# EAGLE design v1 (EAGLE 8.4.2)

## Sheet 1 of 2
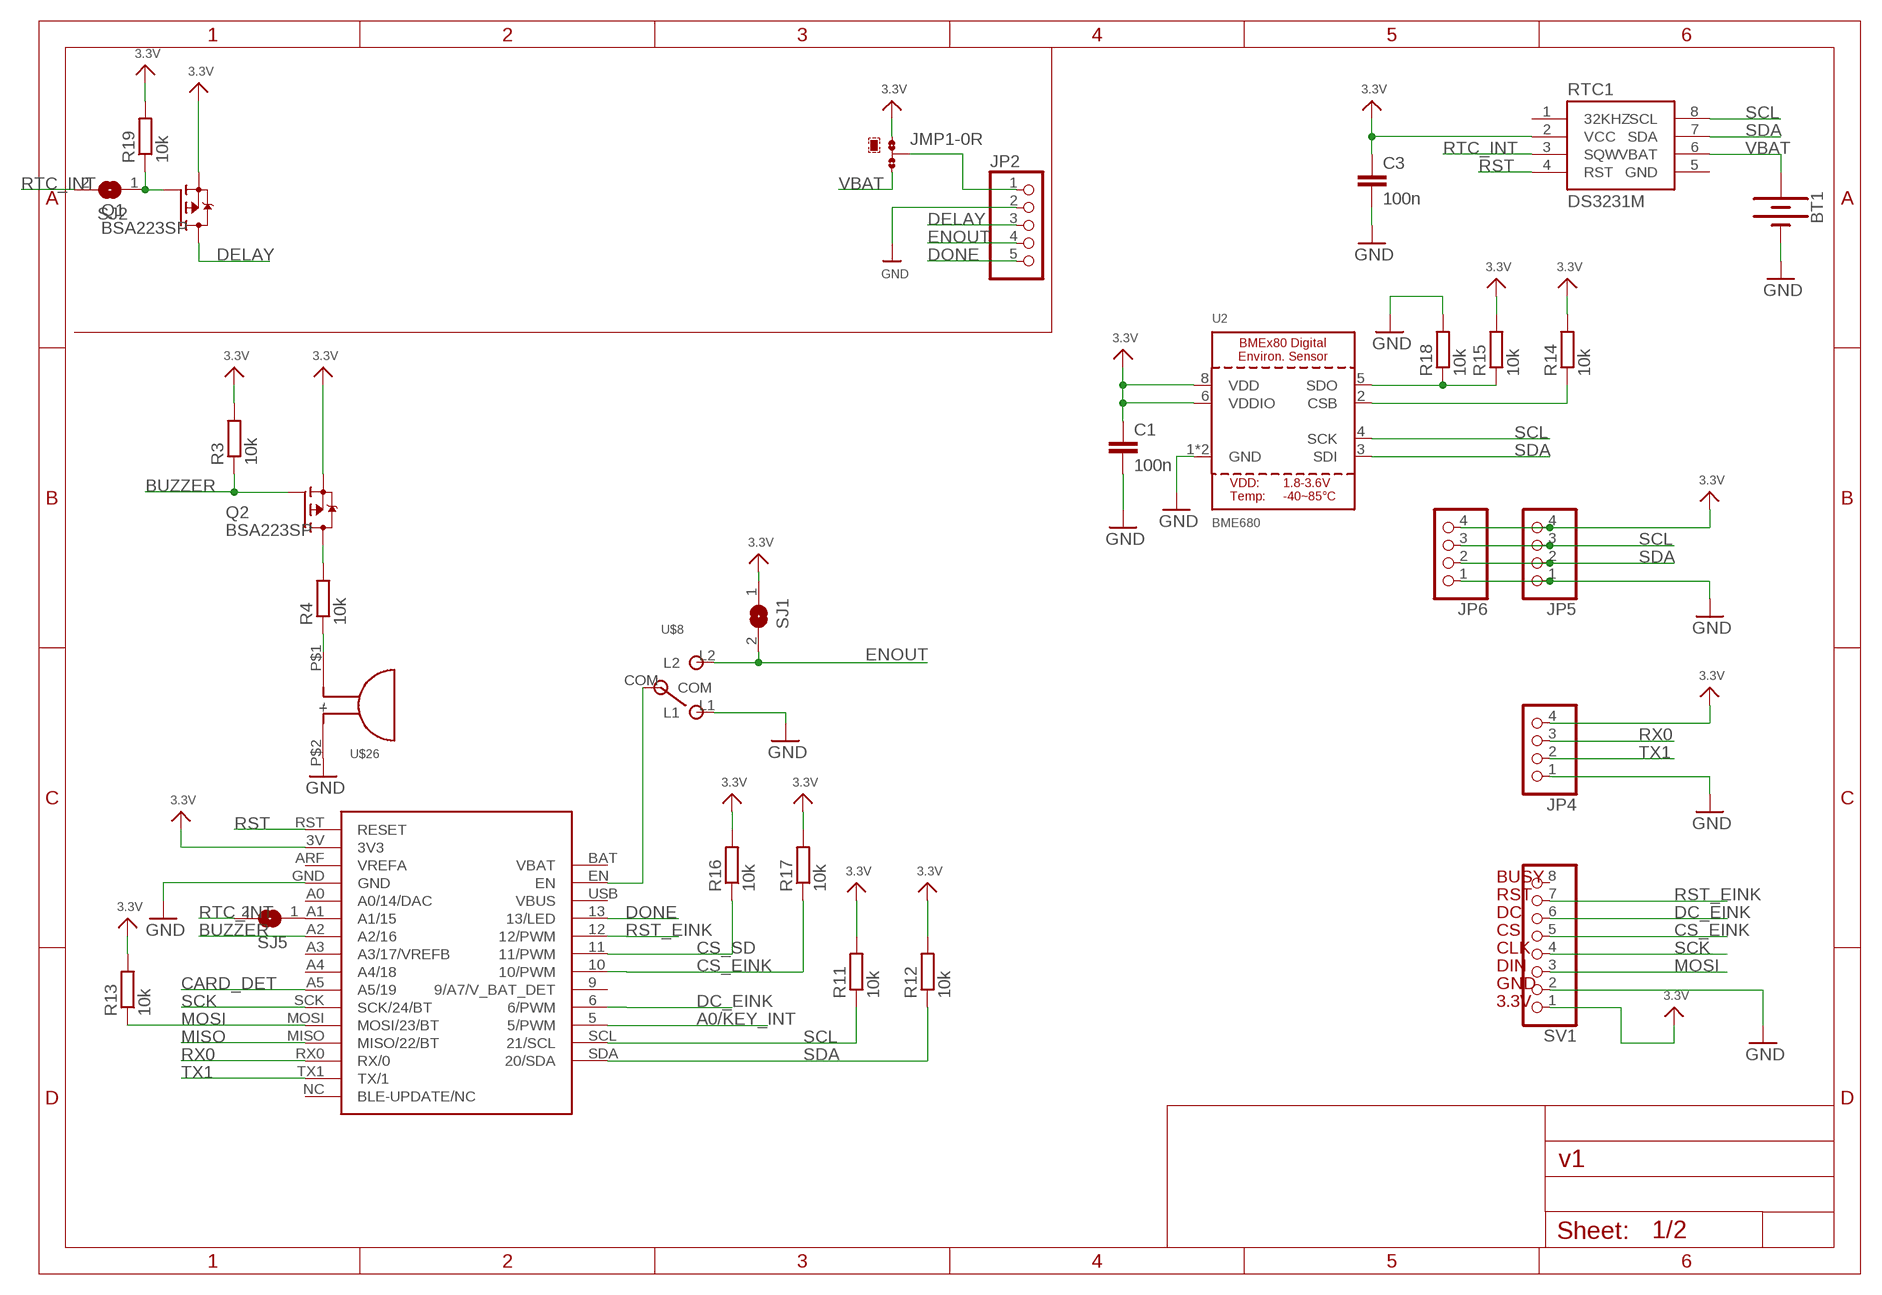
[diagram p0: schematic, sheet 1]

### Parts
BT1  BATTERY-12MM_SMD  [BATTCON_12MM]
C1  100n  C-EUC0805  [C0805]
C3  100n  C-EUC0805  [C0805]
JMP1  0R-JUMPC  [C0R-JMP]
JP2  HEADER-1X570MIL  [1X05_ROUND_70]
JP4  PINHD-1X04_2.54  [1X04]
JP5  PINHD-1X04_2.54  [1X04]
JP6  PINHD-1X04_2.54  [1X04]
Q1  BSA223SP  [SC75_INFINEON]
Q2  BSA223SP  [SC75_INFINEON]
R3  10k  R-EU_R0805  [R0805]
R4  10k  R-EU_R0805  [R0805]
R11  10k  R-EU_R0805  [R0805]
R12  10k  R-EU_R0805  [R0805]
R13  10k  R-EU_R0805  [R0805]
R14  10k  R-EU_R0805  [R0805]
R15  10k  R-EU_R0805  [R0805]
R16  10k  R-EU_R0805  [R0805]
R17  10k  R-EU_R0805  [R0805]
R18  10k  R-EU_R0805  [R0805]
R19  10k  R-EU_R0805  [R0805]
RTC1  DS3231M  [SO08]
SJ1  SOLDERJUMPERCLOSED  [SOLDERJUMPER_CLOSEDWIRE]
SJ2  SOLDERJUMPERCLOSED  [SOLDERJUMPER_CLOSEDWIRE]
SJ5  SOLDERJUMPERCLOSED  [SOLDERJUMPER_CLOSEDWIRE]
SV1  PINHD-1X08_2.54  [1X08]
U2  BME680  BME280  [BME280]
U$8  MSK-12C02_SMD_SPDT_SWITCH  [MSK-12C02]
U$15  FEATHER_M0  [FEATHER_M0]
U$26  DTS402G1  [DET402G1]

### Nets
3.3V: C1.1 C3.1 JMP1.1 JP4.4 JP5.4 JP6.4 Q1.3(S) Q2.3(S) R3.2 R11.2 R12.2 R13.2 R14.2 R15.2 R16.2 R17.2 R19.2 RTC1.2(VCC) SJ1.1 SV1.1 U2.6(VDDIO) U2.8(VDD) U$15.3V(3V3) ; also sheet 2
A0/KEY_INT: U$15.5(5/PWM) ; also sheet 2
BUZZER: Q2.1(G) R3.1 U$15.A2(A2/16)
CARD_DET: U$15.A5(A5/19) ; also sheet 2
CS_EINK: R17.1 SV1.5 U$15.10(10/PWM)
CS_SD: R16.1 U$15.11(11/PWM) ; also sheet 2
DC_EINK: SV1.6 U$15.6(6/PWM)
DELAY: JP2.3 Q1.2(D) ; also sheet 2
DONE: JP2.5 U$15.13(13/LED)
ENOUT: JP2.4 SJ1.2 U$8.L2
GND: BT1.GND(-) C1.2 C3.2 JP2.2 JP4.1 JP5.1 JP6.1 R18.2 SV1.2 U2.1(GND) U2.7(GND) U$8.L1 U$15.GND U$26.P$2(-) ; also sheet 2
MISO: U$15.MISO(MISO/22/BT) ; also sheet 2
MOSI: R13.1 SV1.3 U$15.MOSI(MOSI/23/BT) ; also sheet 2
N$1: JMP1.2 JP2.1
N$2: Q1.1(G) R19.1 SJ2.1
N$5: R14.1 U2.2(CSB)
N$6: SJ5.1 U$15.A1(A1/15)
N$7: U$8.COM U$15.EN
N$8: Q2.2(D) R4.2
N$9: R4.1 U$26.P$1(+)
N$12: R15.1 R18.1 U2.5(SDO)
RST: RTC1.4(RST) U$15.RST(RESET)
RST_EINK: SV1.7 U$15.12(12/PWM)
RTC_INT: RTC1.3(SQW) SJ2.2 SJ5.2
RX0: JP4.3 U$15.RX0(RX/0)
SCK: SV1.4 U$15.SCK(SCK/24/BT) ; also sheet 2
SCL: JP5.3 JP6.3 R11.1 RTC1.8(SCL) U2.4(SCK) U$15.SCL(21/SCL) ; also sheet 2
SDA: JP5.2 JP6.2 R12.1 RTC1.7(SDA) U2.3(SDI) U$15.SDA(20/SDA) ; also sheet 2
TX1: JP4.2 U$15.TX1(TX/1)
VBAT: BT1.PWR@1(+) JMP1.3 RTC1.6(VBAT)
Unconnected: RTC1.1(32KHZ) SV1.8 U$15.9(9/A7/V_BAT_DET) U$15.A0(A0/14/DAC) U$15.A3(A3/17/VREFB) U$15.A4(A4/18) U$15.ARF(VREFA) U$15.BAT(VBAT) U$15.NC(BLE-UPDATE/NC) U$15.USB(VBUS)

### Notes on the sheet
- BUSY
- RST
- DC
- CS
- CLK
- DIN
- GND
- 3.3V

## Sheet 2 of 2
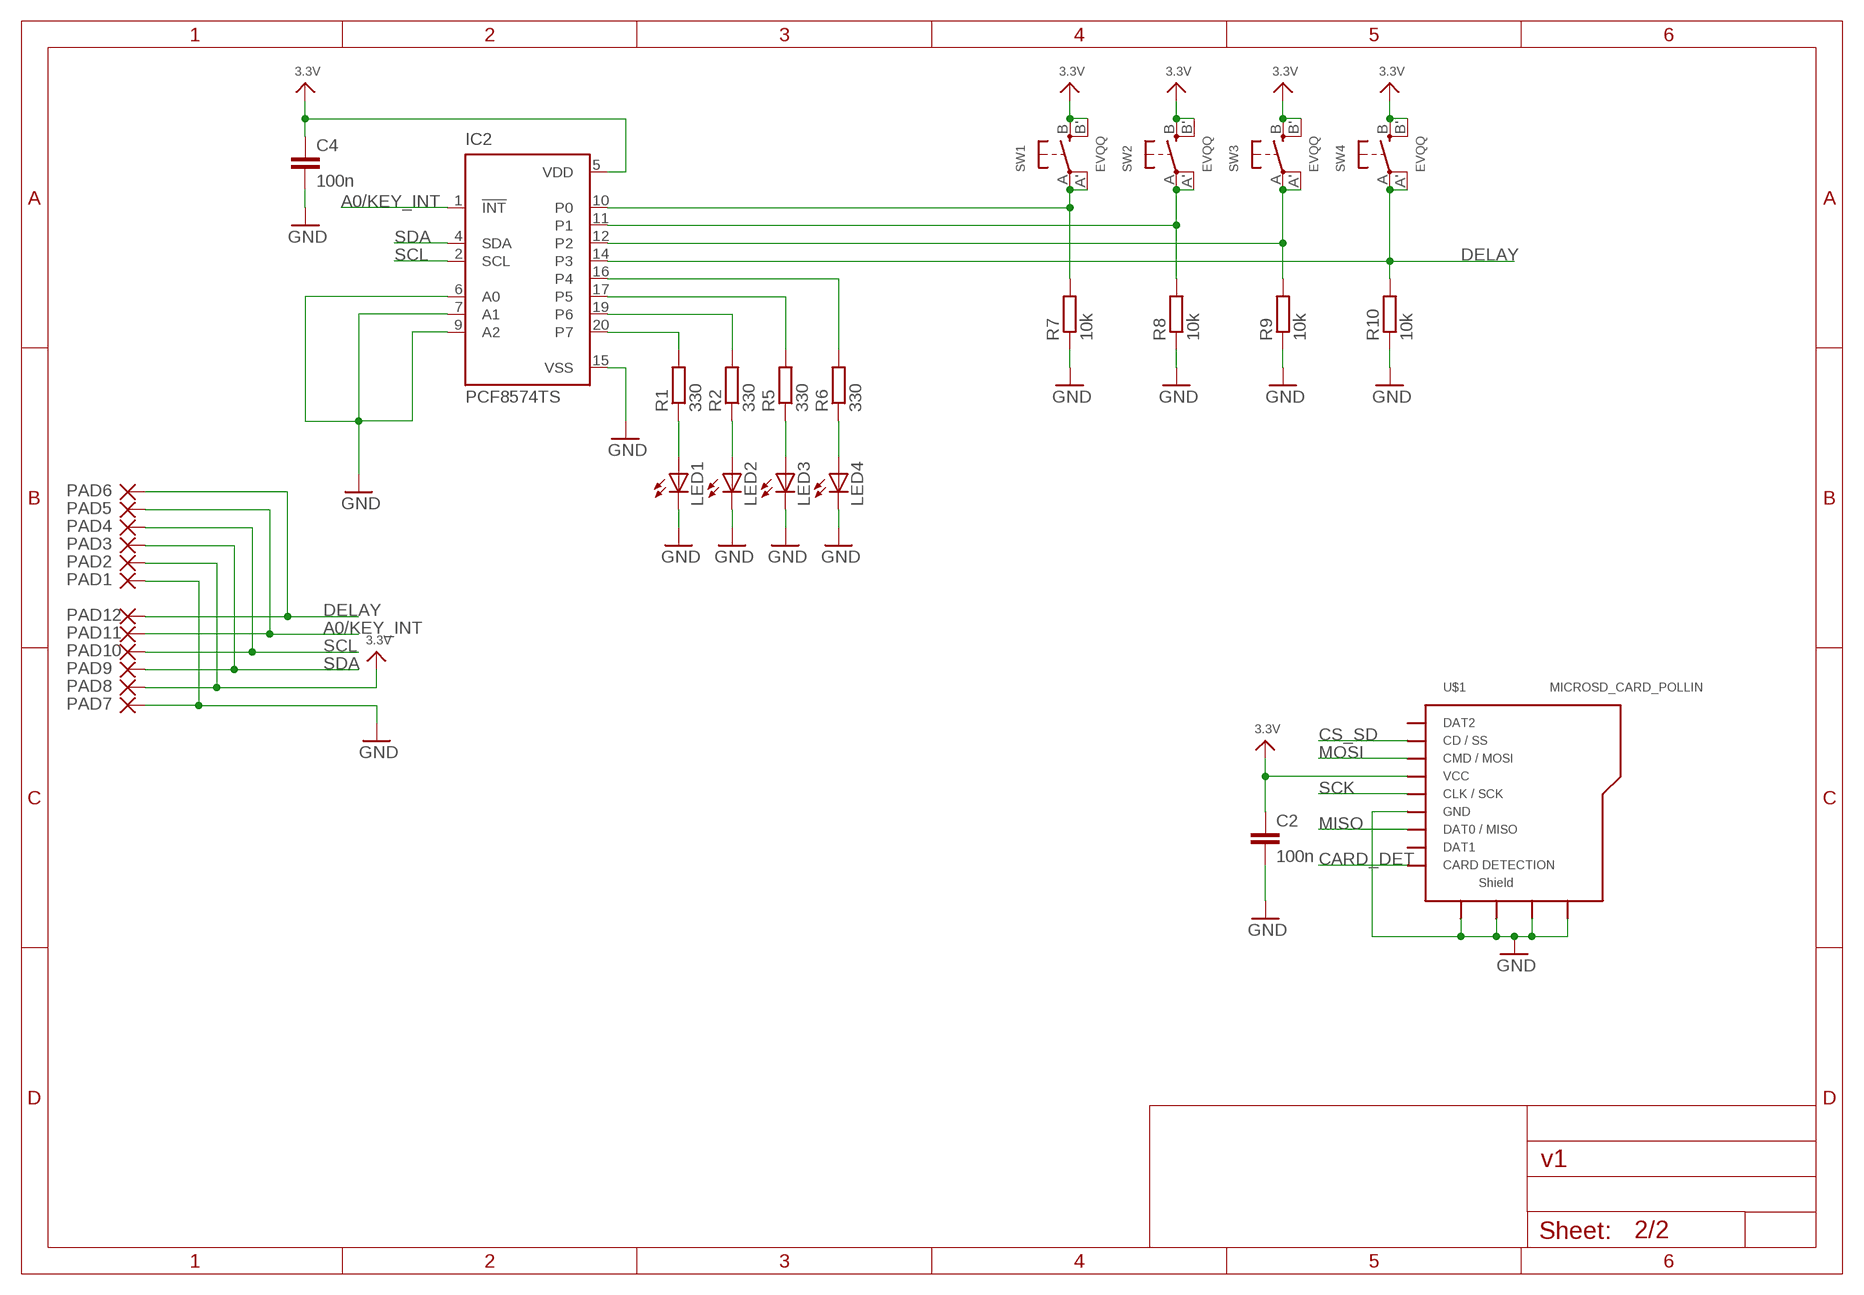
[diagram p1: schematic, sheet 2]

### Parts
C2  100n  C-EUC0805  [C0805]
C4  100n  C-EUC0805  [C0805]
IC2  PCF8574TS  [SSOP20]
LED1  LEDCHIPLED_0805  [CHIPLED_0805]
LED2  LEDCHIPLED_0805  [CHIPLED_0805]
LED3  LEDCHIPLED_0805  [CHIPLED_0805]
LED4  LEDCHIPLED_0805  [CHIPLED_0805]
PAD1  WIREPADSMD1,27-254  [SMD1,27-2,54]
PAD2  WIREPADSMD1,27-254  [SMD1,27-2,54]
PAD3  WIREPADSMD1,27-254  [SMD1,27-2,54]
PAD4  WIREPADSMD1,27-254  [SMD1,27-2,54]
PAD5  WIREPADSMD1,27-254  [SMD1,27-2,54]
PAD6  WIREPADSMD1,27-254  [SMD1,27-2,54]
PAD7  WIREPADSMD1,27-254  [SMD1,27-2,54]
PAD8  WIREPADSMD1,27-254  [SMD1,27-2,54]
PAD9  WIREPADSMD1,27-254  [SMD1,27-2,54]
PAD10  WIREPADSMD1,27-254  [SMD1,27-2,54]
PAD11  WIREPADSMD1,27-254  [SMD1,27-2,54]
PAD12  WIREPADSMD1,27-254  [SMD1,27-2,54]
R1  330  R-EU_R0805  [R0805]
R2  330  R-EU_R0805  [R0805]
R5  330  R-EU_R0805  [R0805]
R6  330  R-EU_R0805  [R0805]
R7  10k  R-EU_R0805  [R0805]
R8  10k  R-EU_R0805  [R0805]
R9  10k  R-EU_R0805  [R0805]
R10  10k  R-EU_R0805  [R0805]
SW1  EVQQ  SWITCH_TACT_SMT_EVQQ2_SMALL  [EVQ-Q2_SMALLER]
SW2  EVQQ  SWITCH_TACT_SMT_EVQQ2_SMALL  [EVQ-Q2_SMALLER]
SW3  EVQQ  SWITCH_TACT_SMT_EVQQ2_SMALL  [EVQ-Q2_SMALLER]
SW4  EVQQ  SWITCH_TACT_SMT_EVQQ2_SMALL  [EVQ-Q2_SMALLER]
U$1  MICROSD_CARD_POLLIN  [MR**-AP*03**]

### Nets
3.3V: C2.1 C4.1 IC2.5(VDD) PAD2.1(P) PAD8.1(P) SW1.B'(S1) SW1.B(S) SW2.B'(S1) SW2.B(S) SW3.B'(S1) SW3.B(S) SW4.B'(S1) SW4.B(S) U$1.VCC ; also sheet 1
A0/KEY_INT: IC2.1(!INT) PAD5.1(P) PAD11.1(P) ; also sheet 1
CARD_DET: U$1.CARD_DETECTION(CARD_D) ; also sheet 1
CS_SD: U$1.DAT3/CS(CD/SS) ; also sheet 1
DELAY: IC2.14(P3) PAD6.1(P) PAD12.1(P) R10.2 SW4.A'(P1) SW4.A(P) ; also sheet 1
GND: C2.2 C4.2 IC2.6(A0) IC2.7(A1) IC2.9(A2) IC2.15(VSS) LED1.C LED2.C LED3.C LED4.C PAD1.1(P) PAD7.1(P) R7.1 R8.1 R9.1 R10.1 U$1.GND U$1.SHD_1(SHD1) U$1.SHD_2(SHD2) U$1.SHD_3(SHD3) U$1.SHD_4(SHD4) ; also sheet 1
MISO: U$1.DAT0(DAT0/MISO) ; also sheet 1
MOSI: U$1.CMD(CMD/MOSI) ; also sheet 1
N$3: IC2.10(P0) R7.2 SW1.A'(P1) SW1.A(P)
N$4: IC2.11(P1) R8.2 SW2.A'(P1) SW2.A(P)
N$13: IC2.12(P2) R9.2 SW3.A'(P1) SW3.A(P)
N$20: IC2.20(P7) R1.2
N$21: IC2.19(P6) R2.2
N$22: IC2.17(P5) R5.2
N$23: IC2.16(P4) R6.2
N$24: LED4.A R6.1
N$25: LED3.A R5.1
N$26: LED2.A R2.1
N$27: LED1.A R1.1
SCK: U$1.CLK(CLK/SCK) ; also sheet 1
SCL: IC2.2(SCL) PAD4.1(P) PAD10.1(P) ; also sheet 1
SDA: IC2.4(SDA) PAD3.1(P) PAD9.1(P) ; also sheet 1
Unconnected: U$1.DAT1 U$1.DAT2

## Power pins joined to a net without a drawn wire
GND: RTC1.5(GND)

## Library data of the parts
BT1 = SparkFun-Batteries:BATTERY: Battery - Single Cell A variety of battery chemistries, sizes, and footprints. Device List: 20MM_PTH - Coin Cell Battery Holder - 20mm (PTH) <https://www.sparkfun.com/products/783> 6.8MM_PTH - Coin Cell Battery Holder - 6.8MM(SMD) <https://www.digikey.com/product-detail/en/seiko-instruments/MS621FE-FL11E/728-1057-ND/1889208?WT.srch=1&gclid=CNOQ5a6LzdQCFZS2wAodXCkE0g> 12MM_SMD - Coin Cell Battery Holder - 12mm (SMD) <https://www.sparkfun.com/products/10592> 12MM_PTH - Coin Cell Battery Holder - 12mm (PTH) <https://www.sparkfun.com/products/7948> 20MM_SMD - 20mm Coin Cell Battery Holder (SMD) (2 legs) Used on the Big Time Watch Kit <https://www.sparkfun.com/products/11734> 20MM_SMD_4LEGS - Coin Cell Battery Holder - 20mm (SMD) <https://www.sparkfun.com/products/11892> 20MM_SMD_4LEGS_OVERPASTE - Coin Cell Battery Holder - 20mm (SMD) <https://www.sparkfun.com/products/11892> (Over-paste on the legs) 24.5MM_PTH - Coin Cell Battery Holder - 24.5mm (PTH) <https://www.sparkfun.com/products/8863> 9V - 9V Battery Holder - PC Mount Used on the SparkFun SparkPunk Sound Kit <https://www.sparkfun.com/products/11177> and SparkFun SparkPunk Sequencer Kit <https://www.sparkfun.com/products/12707> 18650 - Battery Holder - 18650 (PTH) <https://www.sparkfun.com/products/13113> AA - Battery Holder - 1xAA (PTH) <https://www.sparkfun.com/products/7949> AAA - Battery Holder - 1xAAA (PTH) <https://www.sparkfun.com/products/12718> AA_KIT - Battery Holder - 1xAA (PTH) <https://www.sparkfun.com/products/7949> Special kit package - pads only have exposed copper on one side of the board. AAA_KIT - Battery Holder - 1xAAA (PTH) <https://www.sparkfun.com/products/12718> Special kit package - pads only have exposed copper on one side of the board.; PROD_ID: BATT-08044; SF_SKU: PRT-10592
C1-C4 = rcl:C-EU: CAPACITOR, European symbol
IC2 = micro-philips:PCF8574: I2C-Bus Remote 8-bit I/O expander http://www.semiconductors.philips.com/acrobat_download/datasheets/PCF8574_4.pdf; MPN: PCF8574TS/3,118; OC_FARNELL: 1506644; OC_NEWARK: 70R6873
JMP1 = jump-0r-smd:0R-JUMP: SMD 0R 0805 Jumper
JP2 = microbuilder:HEADER-1X5: PIN HEADER
JP4-JP6 = pinhead-2:PINHD-1X04: PIN HEADER
LED1-LED4 = led:LED: LED OSRAM: - CHIPLED LG R971, LG N971, LY N971, LG Q971, LY Q971, LO R971, LY R971 LH N974, LH R974 LS Q976, LO Q976, LY Q976 LO Q996 - Hyper CHIPLED LW Q18S LB Q993, LB Q99A, LB R99A - SideLED LS A670, LO A670, LY A670, LG A670, LP A670 LB A673, LV A673, LT A673, LW A673 LH A674 LY A675 LS A676, LA A676, LO A676, LY A676, LW A676 LS A679, LY A679, LG A679 - Hyper Micro SIDELED® LS Y876, LA Y876, LO Y876, LY Y876 LT Y87S - SmartLED LW L88C, LW L88S LB L89C, LB L89S, LG L890 LS L89K, LO L89K, LY L89K LS L896, LA L896, LO L896, LY L896 - TOPLED LS T670, LO T670, LY T670, LG T670, LP T670 LSG T670, LSP T670, LSY T670, LOP T670, LYG T670 LG T671, LOG T671, LSG T671 LB T673, LV T673, LT T673, LW T673 LH T674 LS T676, LA T676, LO T676, LY T676, LB T676, LH T676, LSB T676, LW T676 LB T67C, LV T67C, LT T67C, LS T67K, LO T67K, LY T67K, LW E67C LS E67B, LA E67B, LO E67B, LY E67B, LB E67C, LV E67C, LT E67C LW T67C LS T679, LY T679, LG T679 LS T770, LO T770, LY T770, LG T770, LP T770 LB T773, LV T773, LT T773, LW T773 LH T774 LS E675, LA E675, LY E675, LS T675 LS T776, LA T776, LO T776, LY T776, LB T776 LHGB T686 LT T68C, LB T68C - Hyper Mini TOPLED® LB M676 - Mini TOPLED Santana® LG M470 LS M47K, LO M47K, LY M47K Source: http://www.osram.convergy.de LUXEON: - LUMILED® LXK2-PW12-R00, LXK2-PW12-S00, LXK2-PW14-U00, LXK2-PW14-V00 LXK2-PM12-R00, LXK2-PM12-S00, LXK2-PM14-U00 LXK2-PE12-Q00, LXK2-PE12-R00, LXK2-PE12-S00, LXK2-PE14-T00, LXK2-PE14-U00 LXK2-PB12-K00, LXK2-PB12-L00, LXK2-PB12-M00, LXK2-PB14-N00, LXK2-PB14-P00, LXK2-PB14-Q00 LXK2-PR12-L00, LXK2-PR12-M00, LXK2-PR14-Q00, LXK2-PR14-R00 LXK2-PD12-Q00, LXK2-PD12-R00, LXK2-PD12-S00 LXK2-PH12-R00, LXK2-PH12-S00 LXK2-PL12-P00, LXK2-PL12-Q00, LXK2-PL12-R00 Source: www.luxeon.com KINGBRIGHT: KA-3528ASYC Source: www.kingbright.com
PAD1-PAD12 = wirepad:WIREPAD: Wire PAD connect wire on PCB
Q1 Q2 = transistor-fet:BSA223SP: OptiMOS(R)-P Small-Signal-Transistor P-Channel, Enhancement mode, Super Logic Level (2.5 V rated) Source: http://www.infineon.com/upload/Document/BSA223SP_Rev1.3.pdf
R1-R19 = rcl:R-EU_: RESISTOR, European symbol
RTC1 = SparkFun-Clocks:DS3231M: DS3231M Real Time Clock Accuracy +/-5ppm. Battery Backup. 2.3V to 5.5V. Datasheet <https://cdn.sparkfun.com/datasheets/Dev/Beagle/DS3231M.pdf> SparkFun Products CryptoCape <https://www.sparkfun.com/products/12773> (DEV-12773) SparkFun CryptoShield <https://www.sparkfun.com/products/13183> (DEV-13183); PROD_ID: IC-11985
SJ1 SJ2 SJ5 = microbuilder:SOLDERJUMPER: SMD Solder JUMPER Solder the two pads together to create a connection, or remove the solder to break it. REFLOW - Use this footprint for solder paste and reflow ovens. WAVE - Use this footprint for hand-soldering (larger pads). CLOSED - Has a trace between the two pads to ensure it is closed by default. The trace needs to be cut to disable the jumper, and can be closed again by creating a solder bridge between the two pads.
SV1 = pinhead-2:PINHD-1X08: PIN HEADER
SW1-SW4 = microbuilder:SWITCH_TACT_SMT: SMT Tact Switches 6x6mm - Digikey: P12940SCT-ND KMR2 (4.6x2.8mm) - Digikey: 401-1426-1-ND EVQ-PQHB55 - Light Touch, 160GF (4.5x4.5mm) - Digikey: P8090SCT-ND KMT0 - KMT021 NGJ LHS (etc.) IP68/Waterproof - Digikey: CKN10289CT-ND
U2 = microbuilder:BME280: BME280 - Environmental Sensor (I2C + SPI)
U$1 = 000_eigene_Bauteile:MICROSD_CARD_POLLIN
U$8 = MSK-12C02 SMD Micro Slider Switch SPDT:MSK-12C02_SMD_SPDT_SWITCH: Footprint of the VIMEX MSK-12C02 SPDT SMD Switch Created by mzst on 17-Jan-2016
U$15 = 000_Simons_Eigene:FEATHER_M0
U$26 = 000_Simons_Eigene:DTS402G1

## Board
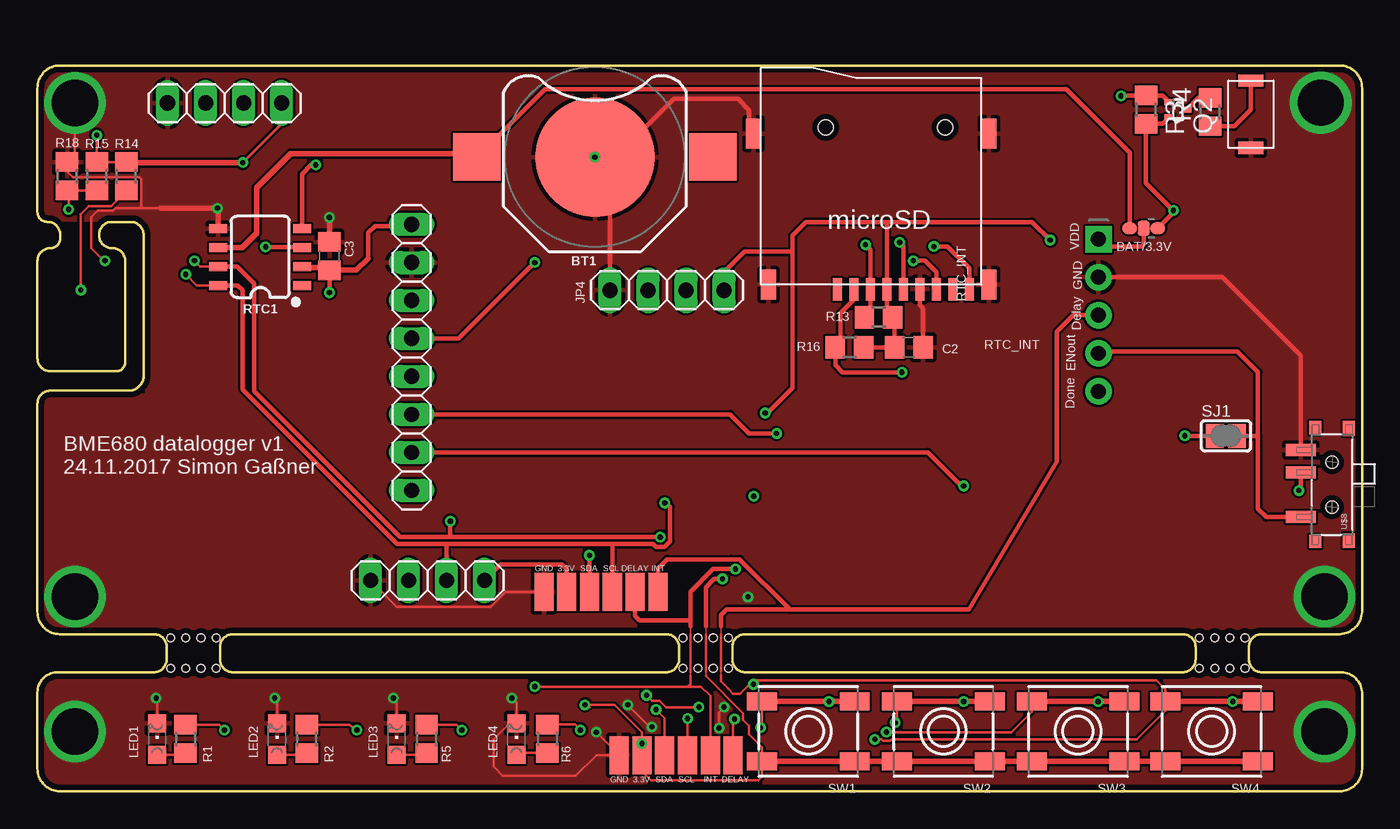
[diagram p2: board, top side]
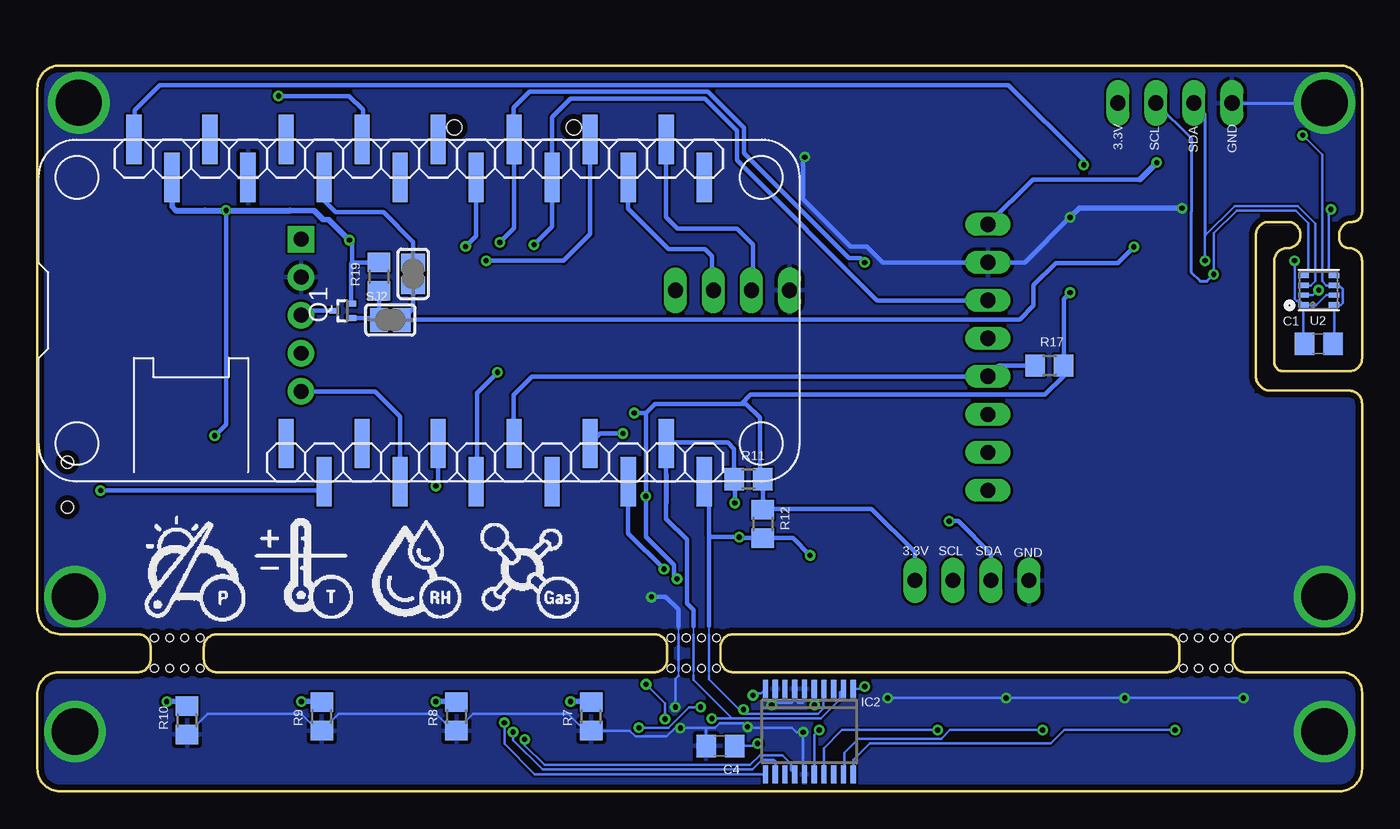
[diagram p3: board, bottom side, seen from below]

Size 88.5 x 48.5 mm. Coordinates in mm from the lower left corner, seen from the top.
Outline: 4.98,38.05 6.23,38.05 arc-90 7.09,37.19 7.09,27.95 arc-90 6.23,26.78 0.87,26.78 arc90 0,25.91 0,12 arc90 1.5,10.5 7.77,10.5 arc-90 8.64,9.64 8.64,8.82 arc-90 7.77,7.96 1.27,7.96 arc90 0,6.5 0,1.5 arc90 1.5,0 87,0 arc90 88.5,1.5 88.5,6.5 arc90 87.12,7.96 81.8,7.96 arc-90 80.94,8.82 80.94,9.64 arc-90 81.8,10.5 86.87,10.5 arc90 88.5,12 88.5,47 arc90 87,48.5 1.5,48.5 arc90 0,47 0,38.72 arc90 0.66,38.05 arc-90 1.53,37.19 1.53,36.96 arc-90 0.87,36.3 arc90 0,35.44 0,28.94 arc90 0.87,28.07 5.26,28.07 arc90 5.87,28.68 5.87,35.44 arc90 5.01,36.3 4.98,36.3 arc-90 4.12,37.17 4.12,37.19 arc-90 4.98,38.05
Outline: 42,10.5 13.06,10.5 arc90 12.19,9.64 12.19,8.82 arc90 13.06,7.96 42,7.96 arc90 42.87,8.82 42.87,9.64 arc90 42,10.5
Outline: 47.29,10.5 76.52,10.5 arc-90 77.38,9.64 77.38,8.82 arc-90 76.52,7.96 47.29,7.96 arc-90 46.42,8.82 46.42,9.64 arc-90 47.29,10.5
Copper layers (1*16): Top 0.0356mm / dielectric 1.5011mm / Bottom 0.0356mm
Design rules "oshpark-2layer *": minimum track width 6mil, minimum drill 13mil, track to track 6mil, track to pad 6mil, pad to pad 6mil, via to via 6mil, smd to smd 6mil, copper to edge 15mil, drill to drill 6mil, minimum pad ring 7mil, minimum via ring 7mil, stop-mask expansion 2.5mil, vias tented up to drill 14mil, thermal gap 10mil
Holes 0.51 mm at 8.89,10.25 9.91,10.25 10.92,10.25 11.94,10.25 8.89,8.21 9.91,8.21 10.92,8.21 11.94,8.21 77.63,10.25 78.65,10.25 79.67,10.25 80.68,10.25 77.63,8.21 78.65,8.21 79.67,8.21 80.68,8.21 43.12,10.25 44.14,10.25 45.15,10.25 46.17,10.25 43.12,8.21 44.14,8.21 45.15,8.21 46.17,8.21
tRestrict: area 0,26.6 to 7.2,38.1
bRestrict: area 0,26.6 to 7.2,38.1

### Footprints (pad centres in the part's own frame; a part is rotated, then mirrored left to right if it is on the bottom)
BATTCON_12MM = smd 8 x 8: GND 0,0 | smd 3.175 x 3.175: PWR@1 -7.874,0; PWR@2 7.874,0
C0805 = smd 1.3 x 1.5: 1 -0.95,0; 2 0.95,0
SSOP20 = smd 0.35 x 1.2: 1 -2.925,-2.85; 2 -2.275,-2.85; 3 -1.625,-2.85; 4 -0.975,-2.85; 5 -0.325,-2.85; 6 0.325,-2.85; 7 0.975,-2.85; 8 1.625,-2.85; 9 2.275,-2.85; 10 2.925,-2.85; 11 2.925,2.85; 12 2.275,2.85; 13 1.625,2.85; 14 0.975,2.85; 15 0.325,2.85; 16 -0.325,2.85; 17 -0.975,2.85; 18 -1.625,2.85; 19 -2.275,2.85; 20 -2.925,2.85
C0R-JMP = smd 0.8 x 1: 1 0,0.938; 3 0,-0.938 | smd 1 x 0.8: 2 0,0
1X05_ROUND_70 = drill 1 pad 1.778 square: 1 -5.08,0 | drill 1 pad 1.778: 2 -2.54,0; 3 0,0; 4 2.54,0; 5 5.08,0
1X04 = drill 1.016 long: 1 -3.81,0; 2 -1.27,0; 3 1.27,0; 4 3.81,0
CHIPLED_0805 = smd 1.2 x 1.2: A 0,-1.05; C 0,1.05
SMD1,27-2,54 = smd 1.27 x 2.54: 1 0,0
SC75_INFINEON = smd 0.4 x 0.65: 1 -0.5,-0.575; 2 0,0.575; 3 0.5,-0.575
R0805 = smd 1.3 x 1.5: 1 -0.95,0; 2 0.95,0
SO08 = smd 0.6 x 1.2: 1 -1.905,-2.8; 2 -0.635,-2.8; 3 0.635,-2.8; 4 1.905,-2.8; 5 1.905,2.8; 6 0.635,2.8; 7 -0.635,2.8; 8 -1.905,2.8
SOLDERJUMPER_CLOSEDWIRE = smd 1.168 x 1.6: 1 -0.762,0; 2 0.762,0 | smd 0.635 x 0.203: WIRE 0,0
1X08 = drill 1.016 long: 1 -8.89,0; 2 -6.35,0; 3 -3.81,0; 4 -1.27,0; 5 1.27,0; 6 3.81,0; 7 6.35,0; 8 8.89,0
EVQ-Q2_SMALLER = smd 2 x 1.2: A -3.1,-2; A' 3.1,-2; B -3.1,2; B' 3.1,2
BME280 = smd 0.7 x 0.35: 1 1.025,0.975; 2 1.025,0.325; 3 1.025,-0.325; 4 1.025,-0.975; 5 -1.025,-0.975; 6 -1.025,-0.325; 7 -1.025,0.325; 8 -1.025,0.975
MR**-AP*03** = smd 0.6 x 1.5: CARD_DETECTION -6.55,0.3; CLK -2.15,0.3; CMD 0.05,0.3; DAT0 -4.35,0.3; DAT1 -5.45,0.3; DAT2 2.25,0.3; DAT3/CS 1.15,0.3; GND -3.25,0.3; VCC -1.05,0.3 | smd 1 x 2: SHD_1 -7.85,0; SHD_2 6.85,0; SHD_3 -7.85,-10.1; SHD_4 7.85,-10.1 | hole 1: -4.95,-10.5; 3.05,-10.5
MSK-12C02 = smd 0.8 x 2: COM 0.823,2.1; L1 2.323,2.1; L2 -2.177,2.1 | smd 1 x 0.8: GND@1 -3.75,-1.125; GND@4 3.75,-1.125 | smd 0.9 x 0.8: GND@2 -3.8,1.125; GND@3 3.8,1.125 | hole 0.8: -1.5,0; 1.5,0
FEATHER_M0 = smd 1.016 x 3.302 bottom: 3V -16.51,-9.525; 5 13.97,10.795; 6 11.43,8.255; 9 8.89,10.795; 10 6.35,8.255; 11 3.81,10.795; 12 1.27,8.255; 13 -1.27,10.795; A0 -8.89,-12.065; A1 -6.35,-9.525; A2 -3.81,-12.065; A3 -1.27,-9.525; A4 1.27,-12.065; A5 3.81,-9.525; ARF -13.97,-12.065; BAT -8.89,8.255; EN -6.35,10.795; GND -11.43,-9.525; MISO 11.43,-12.065; MOSI 8.89,-9.525; NC 19.05,-9.525; RST -19.05,-12.065; RX0 13.97,-9.525; SCK 6.35,-12.065; SCL 16.51,8.255; SDA 19.05,10.795; TX1 16.51,-12.065; USB -3.81,8.255
DET402G1 = smd 1.676 x 0.813: P$1 0,2.25; P$2 0,-2.25

### Placement (x,y rotation side)
BT1  37.24,42.39 0 top
C1  2.9,29.9 180 bottom
C2  58.22,29.67 0 top
C3  19.51,35.77 90 top
C4  42.88,3.03 180 bottom
IC2  36.93,4 180 bottom
JMP1  73.92,37.63 270 top
JP2  70.89,31.81 270 top
JP4  42.07,33.48 0 top
JP5  26.06,14.09 0 top
JP6  12.5,46 0 top
LED1  8,3.5 0 top
LED2  16,3.5 0 top
LED3  24,3.5 0 top
LED4  32,3.5 0 top
PAD1  33.84,13.33 0 top
PAD2  35.36,13.33 0 top
PAD3  36.88,13.33 0 top
PAD4  38.41,13.33 0 top
PAD5  39.93,13.33 0 top
PAD6  41.46,13.33 0 top
PAD7  38.86,2.42 0 top
PAD8  40.39,2.42 0 top
PAD9  41.91,2.42 0 top
PAD10  43.44,2.42 0 top
PAD11  44.96,2.42 0 top
PAD12  46.48,2.42 0 top
Q1  68.13,32.11 90 bottom
Q2  76.2,45.55 270 top
R1  9.89,3.5 90 top
R2  18,3.5 90 top
R3  74.07,45.55 270 top
R4  78.34,45.4 90 top
R5  26,3.5 90 top
R6  34.07,3.51 90 top
R7  51.5,5 90 bottom
R8  60.5,5 90 bottom
R9  69.5,5 90 bottom
R10  78.5,4.75 90 bottom
R11  41,20.86 0 bottom
R12  40.04,17.87 90 bottom
R13  56.2,31.68 0 top
R14  5.95,41.1 90 top
R15  3.97,41.1 90 top
R16  54.26,29.67 0 top
R17  20.88,28.45 0 bottom
R18  1.98,41.1 90 top
R19  65.69,34.4 90 bottom
RTC1  14.88,35.72 90 top
SJ1  79.4,23.76 0 top
SJ2  64.93,31.5 0 bottom
SJ5  63.4,34.58 270 bottom
SV1  25,29 270 top
SW1  51.5,4 180 top
SW2  60.53,4 180 top
SW3  69.53,4 180 top
SW4  78.45,4 180 top
U2  2.9,33.48 180 bottom
U$1  55.71,33.86 180 top
U$8  86.5,20.5 90 top
U$14  GASLOGO45MM  [BME680_LOGO_30MM]  81.75,10.96 0 bottom
U$15  63,31.5 180 top
U$26  81.08,45.25 0 top

### Tracks (layer width: path | path; a pad name or v marks a point on that pad's centre or on a via)
3.3V  (via drill 0.35)
  Top 0.102: 44.66,7.76 44.66,8 | 44.66,11.03 44.66,10.5
  Top 0.152: v3.96,43.85 R15.2 R14.2 | 36.88,5.62 36.73,5.62 v36.58,5.78 38.56,5.78 40.39,3.95 v40.39,3.18 PAD8.1 40.39,1.97 40.24,1.81 40.24,1.51 41,0.75 48.16,0.75 48.4,0.99 SW1.B' 48.4,2.94 47.55,3.79 47.55,4.38 47.15,4.78 47.15,5.23 44.66,7.72 44.66,7.76 | 44.66,10.5 44.66,8
  Top 0.203: JP6.4 16.31,44.61 v13.72,42.02
  Top 0.305: 56.77,38.05 51.36,38.05 50.45,37.14 50.45,36.07 | 56.77,38.05 66.45,38.05 v67.67,36.84 | v19.51,33.33 C3.1 | R16.2 C2.1 57.27,31.57 R13.2 56.76,32.08 U$1.VCC 56.77,33.57 56.77,38.05 | JP4.4 45.87,34.7 47.25,36.07 50.45,36.07 | 44.66,11.03 44.66,13.63 45.22,14.2 v45.77,14.2 | PAD2.1 35.36,14.85 35.05,15.16 30.94,15.16 JP5.4 | 22.1,35.62 22.1,37.32 22.56,37.78 24.89,37.78 SV1.1 | v48.62,25.28 48.77,25.28 50.45,26.96 50.45,36.07 | JMP1.1 75.9,38.67 v75.9,38.82 74.07,40.65 R3.2 75.18,44.6 Q2.3 | v76.66,23.76 SJ1.1
  Top 0.381: SW4.B SW4.B' SW3.B SW3.B' SW2.B SW2.B' SW1.B SW1.B' | RTC1.2 17.75,35.01 19.05,35.01 19.24,34.82 C3.1 21.3,34.82 22.1,35.62 | R14.2 5.98,42.02 v13.72,42.02
  Bottom 0.152: IC2.5 36.6,5.8 v36.58,5.78 | C1.1 1.84,29.88 1.87,29.92 U2.8 1.43,32.51 1.3,32.64 1.3,32.89 1.29,32.89 1.29,33.56 1.55,33.81 U2.6 2.38,33.81 2.67,34.09 2.67,42.55 v3.96,43.85 | v40.39,3.18 40.54,3.04 C4.1
  Bottom 0.305: v19.51,33.33 19.93,32.91 R17.2 19.93,27.76 21.19,26.5 40.85,26.5 41.46,25.89 | R11.2 40.2,20.83 | R19.2 67.48,35.35 | v45.77,14.2 45.98,14.4 45.98,15.12 47.86,17 v47.86,19.73 47.86,25.28 | R11.2 40.04,20.85 40.04,18.88 | 40.04,18.88 R12.2 | JP5.4 29.87,15.99 32.77,18.88 40.04,18.88 | v48.62,25.28 47.86,25.28 | 47.86,25.28 47.25,25.89 41.46,25.89 | 41.46,25.89 41.15,25.89 40.24,24.98 40.24,21.05 R11.2 | 14.85,40.89 22,40.89 SV1.1 | 67.48,35.35 67.55,35.28 Q1.3 | 67.48,35.35 67.48,36.65 v67.67,36.84 | v75.9,38.82 75.9,24.52 v76.66,23.76
  Bottom 0.381: v13.72,42.02 14.85,40.89 | U$15.3V 79.51,39.08 79.25,38.82 | v67.67,36.84 69.03,38.2 69.4,38.2 70.02,38.82 71.63,38.82
  Bottom 0.406: 79.25,38.82 77.31,38.82 v75.9,38.82 71.63,38.82
A0/KEY_INT  (via drill 0.35)
  Top 0.102: 43.63,11.03 43.63,10.5 | 43.63,7.98 43.63,7.76
  Top 0.152: 43.51,7 44.35,7 44.96,6.38 PAD11.1 | 43.51,7 v33.23,7 | 43.47,7 43.51,7.03 | 43.63,7.76 43.63,7.15 43.51,7.03 | 43.63,10.5 43.63,7.98 | 43.51,7.03 43.51,7
  Top 0.305: 43.63,11.41 43.63,11.03 | 43.63,11.41 43.63,13.33 45.15,14.85 v46.64,14.85 | PAD5.1 39.93,11.72 40.24,11.41 43.63,11.41
  Bottom 0.152: IC2.1 33.37,6.85 v33.23,7
  Bottom 0.305: U$15.5 49.03,17.25 v46.64,14.85
BUZZER  (via drill 0.35)
  Top 0.305: Q2.1 75.18,46.5 R3.1 72.43,46.5 v72.39,46.47
  Bottom 0.305: v72.39,46.47 67.67,46.47 66.75,45.55 66.75,43.62 U$15.A2
CARD_DET  (via drill 0.35)
  Top 0.305: U$1.CARD_DETECTION 62.26,34.96 60.81,36.41 v59.9,36.41
  Bottom 0.305: v59.9,36.41 59.19,37.11 U$15.A5
CS_EINK
  Bottom 0.305: U$15.10 56.7,23.29 56.7,26.47 55.44,27.73 SV1.5 24.28,28.45 R17.1
CS_SD  (via drill 0.35)
  Top 0.305: v57.76,28 53.8,28 53.31,28.49 R16.1 53.65,30.01 53.65,31.96 54.56,32.87 U$1.DAT3/CS
  Bottom 0.305: U$15.11 59.13,20.76 59.13,26.62 v57.76,28
DC_EINK  (via drill 0.35)
  Top 0.305: SV1.6 46.27,25.19 47.55,23.91 v49.38,23.91
  Bottom 0.305: 51.67,23.34 U$15.6 50.91,23.91 v49.38,23.91
DELAY  (via drill 0.35)
  Top 0.102: 45.68,7.76 45.68,8.02 | 45.68,11.03 45.68,10.5
  Top 0.152: v55.95,3.47 56.38,3.47 56.48,3.37 56.96,3.37 57.08,3.49 73.46,3.49 75.35,5.38 SW4.A' 75.35,6.82 74.75,7.41 48.1,7.41 | 48.1,7.41 47.84,7.41 46.95,6.53 46.47,6.53 46.13,6.87 46.13,6.89 45.68,7.34 45.68,7.76 | 45.68,10.5 45.68,8.02 | PAD12.1 46.48,4.75 v46.57,4.83 | v47.84,7.15 48.1,7.41
  Top 0.305: 50.27,12.15 46.03,12.15 45.68,11.8 45.68,11.03 | 50.27,12.15 46.91,15.51 46.36,15.51 46.37,15.51 42.06,15.51 41.46,14.9 PAD6.1 | 50.27,12.15 62.22,12.15 68.13,22.05 68.13,30.74 69.2,31.81 JP2.3
  Top 0.381: SW4.A' v79.86,6 SW4.A
  Bottom 0.152: 78.8,6 R10.2 | IC2.14 38.15,1.4 38.15,1.85 38.72,2.42 40.24,2.42 40.9,1.76 54.63,1.76 55.95,3.08 v55.95,3.47 | v46.57,4.83 46.57,5.88 v47.84,7.15
  Bottom 0.305: 70.43,31.35 JP2.3 70.59,32.11 Q1.2
  Bottom 0.381: v79.86,6 78.8,6
DONE
  Bottom 0.305: U$15.13 64.27,25.06 65.95,26.73 JP2.5
ENOUT
  Top 0.305: U$8.L2 82.1,18.32 81.54,18.88 81.54,23.76 | 81.54,23.76 81.54,28.03 80.16,29.4 71.02,29.4 JP2.4 | SJ1.2 81.54,23.76
GND  (via drill 0.35, 3.1)
  Top 0.152: LED1.C 8,6.16 v7.93,6.23 | v15.85,6.23 16,6.08 LED2.C | LED3.C 24,6.01 v23.78,6.23 | v31.7,6.23 32,5.93 LED4.C 31.54,4.55 30.48,3.49 30.48,1.66 31.09,1.05 35.97,1.05 37.34,2.42 38.71,2.42 | v4.5,35.46 4.42,35.46 3.58,36.3 3.58,38.36 4.04,38.82 5.04,38.82 5.19,38.97 7.01,38.97 | 8.23,38.97 7.01,38.97 | 7.01,38.97 6.92,39.06 6.92,40.9 6.79,41.03 2.36,41.03 1.98,41.41 R18.2 2.5,42.57 v2.5,46 | PAD1.1 31.27,13.33 30.28,12.34 24.01,12.34 JP5.1 | 38.71,2.42 PAD7.1 | v39.44,5.78 40.91,4.31 v41.05,4.31 | v37.34,3.95 38.71,2.58 38.71,2.42 | v45.87,5.62 45.54,5.29 v45.54,4.22
  Top 0.305: U$1.SHD_4 47.55,43.96 47.55,45.52 46.79,46.28 42.52,46.28 38.62,42.39 BT1.GND 38.25,41.37 JP4.1 | C2.2 59.17,32.28 58.96,32.49 U$1.GND | U$8.L1 84.4,29.12 79.17,34.35 JP2.2
  Top 0.381: RTC1.5 12.08,38.66 v12.02,38.97 8.23,38.97 | v19.51,38.36 C3.2
  Bottom 0.102: 45.68,7.72 45.68,7.74 | 45.68,11.03 45.68,10.5 | 45.68,7.76 45.68,8.06
  Bottom 0.152: v7.93,6.23 v15.85,6.23 v23.78,6.23 v31.7,6.23 | IC2.15 37.18,1.22 37.34,1.38 v37.34,3.95 37.8,3.95 38.1,4.25 41,4.25 v41.05,4.31 41.3,4.56 42.92,4.56 43.22,4.25 43.74,4.25 | IC2.9 39.2,6.11 39.17,6.08 | 39.17,6.08 39.02,5.93 38.1,5.93 37.9,6.13 | 37.9,6.13 IC2.7 | IC2.6 37.25,6.02 37.34,5.93 37.7,5.93 37.9,6.13 | R10.1 77.14,5.17 70.87,5.17 69.75,4.05 R9.1 68.39,5.17 61.88,5.17 60.76,4.05 R8.1 59.39,5.17 53.04,5.17 51.92,4.05 R7.1 48.93,4.05 48.55,3.67 46.46,3.67 45.87,4.25 45.51,4.25 | v39.44,5.78 39.17,6.05 39.17,6.08 | 45.51,4.25 43.74,4.25 | C4.2 43.83,4.17 43.74,4.25 | 45.68,7.76 45.68,7.72 45.87,7.53 v45.87,5.62 | 45.68,8.06 45.68,10.5 | U2.1 3.92,29.98 C1.2 | U2.7 2.38,33.16 3.05,32.49 3.91,32.49 U2.1 | U2.1 4.17,32.75 4.37,32.75 4.5,32.89 v4.5,35.46 | v45.54,4.22 45.51,4.25
  Bottom 0.203: JP6.1 v2.5,46
  Bottom 0.305: v47.48,12.99 46.52,12.99 45.68,12.15 45.68,11.03 | BT1.GND 37.34,42.29 37.34,39.58 34.17,36.41 33.07,36.41 32.02,35.35 SV1.2 22.52,35.35 v19.51,38.36
  Bottom 0.381: U$15.GND | v19.51,38.36 18.9,38.97 v12.02,38.97
  other vias: 86,13 86,4 2.5,13 2.5,4 37.24,42.39 85.74,46.02
  pour Top: 0,48.42 88.51,48.42 88.51,0 0,0
  pour Bottom: 0,48.42 88.51,48.42 88.51,0 0,0
MISO  (via drill 0.35)
  Top 0.305: v58.52,35.46 59.29,35.46 60.06,34.69 U$1.DAT0
  Bottom 0.305: U$15.MISO 51.57,37.23 53.34,35.46 v58.52,35.46
MOSI  (via drill 0.35)
  Top 0.305: 55.4,36.45 v55.32,36.53 55.66,36.2 U$1.CMD 55.66,32.09 R13.1 55.4,31.83
  Bottom 0.305: v55.32,36.53 54.11,37.74 U$15.MOSI 54.1,41.03 54.1,45.07 52.89,46.28 43.89,46.28 41.76,44.15 41.76,42.17 32.4,32.81 SV1.3
N$1
  Top 0.305: JP2.1 70.87,36.92 70.97,36.92 71.48,36.41 73.76,36.41 73.92,36.56 JMP1.2
N$2
  Bottom 0.305: Q1.1 65.8,31.61 SJ2.1 R19.1
N$3  (via drill 0.35)
  Top 0.152: v40.69,6.41 41.05,6.05 41.57,6.05 42,5.62 v44.2,5.62 | v48.31,4.25 48.4,4.34 SW1.A'
  Top 0.381: SW1.A v52.89,6 SW1.A'
  Bottom 0.152: 51.55,6 R7.2 | IC2.10 40.17,6.54 40.39,6.54 40.51,6.41 v40.69,6.41 | v48.31,4.25 46.33,4.25 44.96,5.62 v44.2,5.62
  Bottom 0.381: v52.89,6 51.55,6
N$4  (via drill 0.35)
  Top 0.152: 57.3,5.88 SW2.A' 57.43,4.71 v57.3,4.58
  Top 0.381: SW2.A' v61.88,6 SW2.A
  Bottom 0.152: 60.55,6 R8.2 | IC2.11 55.27,1.15 57.3,3.18 v57.3,4.58 57.3,4.71
  Bottom 0.381: v61.88,6 60.55,6
N$5  (via drill 0.35)
  Top 0.152: R14.1 4.91,39.12 3.43,39.12 2.9,38.59 v2.9,33.5
  Bottom 0.152: U2.2 3.3,33.16 2.97,33.48 2.91,33.48 v2.9,33.5
N$6
  Bottom 0.305: SJ5.1 63.4,36.71 65.38,38.69 68.58,38.69 69.35,39.46 U$15.A1
N$7  (via drill 0.35)
  Top 0.305: U$8.COM 84.4,20.22 v84.28,20.1
  Bottom 0.305: v84.28,20.1 69.65,20.1 69.35,20.4 U$15.EN
N$8
  Top 0.152: R4.2 77.58,46.35
  Top 0.305: 77.58,46.35 Q2.2
N$9
  Top 0.305: R4.1 79.98,44.45 81.08,45.55 U$26.P$1
N$12  (via drill 0.35)
  Top 0.152: v2.09,38.89 2.09,40.05 2.04,40.09 | 2.04,40.09 R18.1 | R15.1 2.1,40.15 2.04,40.09
  Bottom 0.152: U2.5 2.21,34.8 2.21,38.89 v2.09,38.89
N$13  (via drill 0.35)
  Top 0.152: v56.72,3.95 v56.73,3.95 65.08,3.95 66.43,5.3 SW3.A'
  Top 0.381: SW3.A' v70.87,6 SW3.A
  Bottom 0.152: 69.55,6 R9.2 | IC2.12 39.2,2 39.32,2.12 40.08,2.12 40.74,1.46 54.76,1.46 56.72,3.43 v56.72,3.95
  Bottom 0.381: v70.87,6 69.55,6
N$20  (via drill 0.35)
  Top 0.152: v12.5,4.1 12.15,4.45 R1.2
  Bottom 0.152: IC2.20 33.99,1.17 33.99,2.12 32.89,3.21 20.79,3.21 19.91,4.1 v12.5,4.1
N$21  (via drill 0.35)
  Top 0.152: v21.34,4.1 20.84,4.45 R2.2
  Bottom 0.152: IC2.19 34.6,1.21 34.6,2.58 33.65,3.52 28.11,3.52 27.53,4.1 v21.34,4.1
N$22  (via drill 0.35)
  Top 0.152: v28.35,4.1 28,4.45 R5.2
  Bottom 0.152: IC2.17 35.97,1.17 35.97,2.88 34.75,4.1 v28.35,4.1
N$23  (via drill 0.35)
  Top 0.152: R6.2 35.91,4.46 v36.27,4.1
  Bottom 0.152: v36.27,4.1 36.6,3.77 IC2.16
N$24
  Top 0.152: R6.1 32.12,2.56 LED4.A
N$25
  Top 0.152: LED3.A 25.9,2.45 R5.1
N$26
  Top 0.152: LED2.A 17.9,2.45 R2.1
N$27
  Top 0.152: LED1.A 10.4,2.45 R1.1
RST  (via drill 0.35)
  Top 0.305: RTC1.4 17.68,41.25 18.29,41.86 v18.6,41.86
  Bottom 0.305: v18.6,41.86 18.6,42.17 23.62,47.2 80.32,47.2 81.99,45.52 81.99,43.62 U$15.RST
RST_EINK  (via drill 0.35)
  Top 0.305: SV1.7 59.48,22.65 61.72,20.41 v61.88,20.41
  Bottom 0.305: v61.88,20.41 61.73,20.55 U$15.12
RTC_INT  (via drill 0.35)
  Top 0.305: v15.24,36.38 17.65,36.38 RTC1.3
  Bottom 0.305: v15.24,36.38 16.31,35.31 20.45,35.31 21.95,33.82 21.95,32.45 22.86,31.53 63.4,31.53 63.43,31.5 SJ2.2 63.4,32.26 SJ5.2
RX0
  Bottom 0.305: U$15.RX0 49.03,38.93 46.33,36.23 43.89,36.23 43.44,35.77 43.44,33.28 JP4.3
SCK  (via drill 0.35)
  Top 0.305: v57.61,36.68 57.86,36.44 U$1.CLK | SV1.4 28.15,30.27 v33.23,35.34
  Bottom 0.305: v57.61,36.68 56.65,37.64 56.65,43.39 56.7,43.43 56.7,43.57 | 56.7,43.57 56.7,45.67 55.63,46.74 43.7,46.74 41.3,44.34 41.3,42.66 34.29,35.65 33.53,35.65 v33.23,35.34 | U$15.SCK 56.7,43.57
SCL  (via drill 0.35)
  Top 0.152: v9.91,34.55 10.65,33.81 RTC1.8 | PAD10.1 v43.44,4.86
  Top 0.305: RTC1.8 13.39,33.81 13.72,33.48 13.72,26.86 24.04,16.53 27.28,16.53 | v41.91,19.27 42.27,19.02 42.27,16.71 41.88,16.33 41.34,16.33 41.13,16.53 38.41,16.53 | 38.41,16.53 27.28,16.53 | JP5.3 27.33,16.48 27.28,16.53 | PAD4.1 38.41,16.53
  Bottom 0.076: 44.66,7.98 44.66,8.06
  Bottom 0.102: 44.66,11.03 44.66,10.5 | 44.66,7.76 44.66,7.98
  Bottom 0.152: IC2.2 34.9,6.61 34.9,6.16 36.17,4.89 42.09,4.89 | 42.09,4.89 44.66,7.45 44.66,7.76 | 42.09,4.89 43.41,4.89 v43.44,4.86 | 44.66,10.5 44.66,8.06 | U2.4 3.58,34.8 3.58,37.98 4.42,38.82 8.38,38.82 9.91,37.29 v9.91,34.55
  Bottom 0.203: JP6.3 11.41,43.64 11.41,38.72 11.43,38.7 11.43,34.7 10.82,34.09 10.37,34.09 v9.91,34.55
  Bottom 0.305: 44.66,11.03 44.66,12.11 45.11,12.57 45.11,16.83 46.49,18.21 U$15.SCL | U$15.SCL 46.47,19.27 46.48,19.29 | v41.91,19.27 41.91,20.83 R11.1 41.95,22.88 42.37,23.3 46.44,23.3 U$15.SCL
SDA  (via drill 0.35)
  Top 0.152: v10.49,35.46 10.87,35.08 RTC1.7 | PAD9.1 41.91,4.89 v41.33,5.47
  Top 0.305: RTC1.7 13.34,35.08 14.48,33.94 14.48,26.74 24.23,16.99 27.59,16.99 | 27.59,16.99 v41.61,16.99 | v27.59,18.05 27.59,16.99 | PAD3.1 v36.88,15.77
  Bottom 0.102: 43.63,10.5 43.63,11.04 | 43.63,7.76 43.63,7.98
  Bottom 0.152: IC2.4 36,6.81 36,5.54 36.34,5.19 41.33,5.19 | 41.33,5.19 v41.33,5.47 | 41.33,5.19 43.63,7.49 43.63,7.76 | 43.63,7.98 43.63,10.5 | U2.3 3.41,33.81 3.13,34.09 3.13,37.95 4.3,39.12 8.51,39.12 10.49,37.14 v10.49,35.46
  Bottom 0.203: JP6.2 10.49,45.26 10.49,37.14
  Bottom 0.305: JP5.2 24.79,15.87 26.98,18.05 v27.59,18.05 | v36.88,15.77 38.03,16.92 R12.1 41.54,16.92 v41.61,16.99 43.56,16.99 43.63,17.05 | U$15.SDA 43.63,20.38 43.63,17.05 | 43.63,17.05 43.63,11.04
TX1
  Bottom 0.305: U$15.TX1 46.49,38.37 45.72,37.6 41.76,37.6 40.69,36.53 40.69,33.28 JP4.2
VBAT
  Top 0.305: 29.6,42.39 BT1.PWR@1 | 29.6,42.39 30.18,42.96 | 29.6,42.39 29.57,42.35 29.57,41.74 | BT1.PWR@1 33.91,46.92 68.73,46.92 72.98,42.68 JMP1.3 | BT1.PWR@1 29.13,42.63
  Top 0.381: 29.13,42.63 16.92,42.63 14.63,40.34 14.63,37.29 13.69,36.35 RTC1.6

### Text on the board
tPlace: VDD | GND | Delay | ENout | Done | BME680 datalogger v1 / 24.11.2017 Simon Gaßner | GND | 3.3V | SDA | SCL | DELAY | INT | GND | 3.3V | SDA | SCL | INT | DELAY
tNames: BAT/3.3V | RTC_INT | RTC_INT
bNames: GND | SDA | SCL | 3.3V | GND | SDA | SCL | 3.3V